# Altium schematic sheet PCB_Footprint.SchDoc
size A
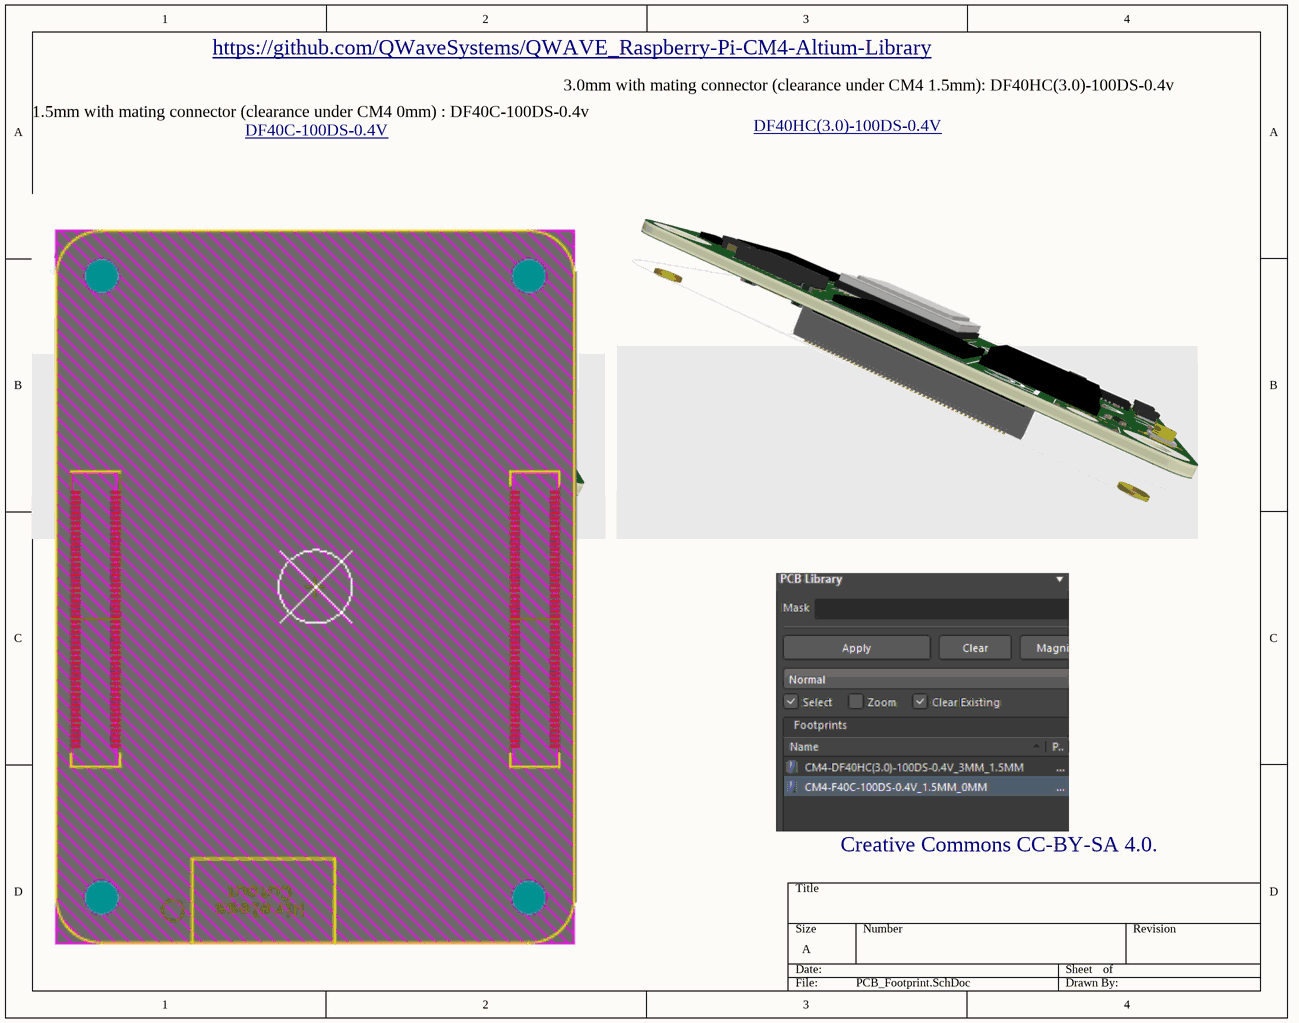
[diagram p0: PCB_Footprint.SchDoc]

## Notes on the sheet
- https://github.com/QWaveSystems/QWAVE_Raspberry-Pi-CM4-Altium-Library
- 1.5mm with mating connector (clearance under CM4 0mm) : DF40C-100DS-0.4v
- DF40C-100DS-0.4V <https://www.hirose.com/product/p/CL0684-4033-4-51>
- 3.0mm with mating connector (clearance under CM4 1.5mm): DF40HC(3.0)-100DS-0.4v
- DF40HC(3.0)-100DS-0.4V <https://www.hirose.com/product/p/CL0684-4151-0-51>
- Creative Commons CC-BY-SA 4.0.